# Altium schematic sheet WheatstoneBridge.SchDoc
size A3
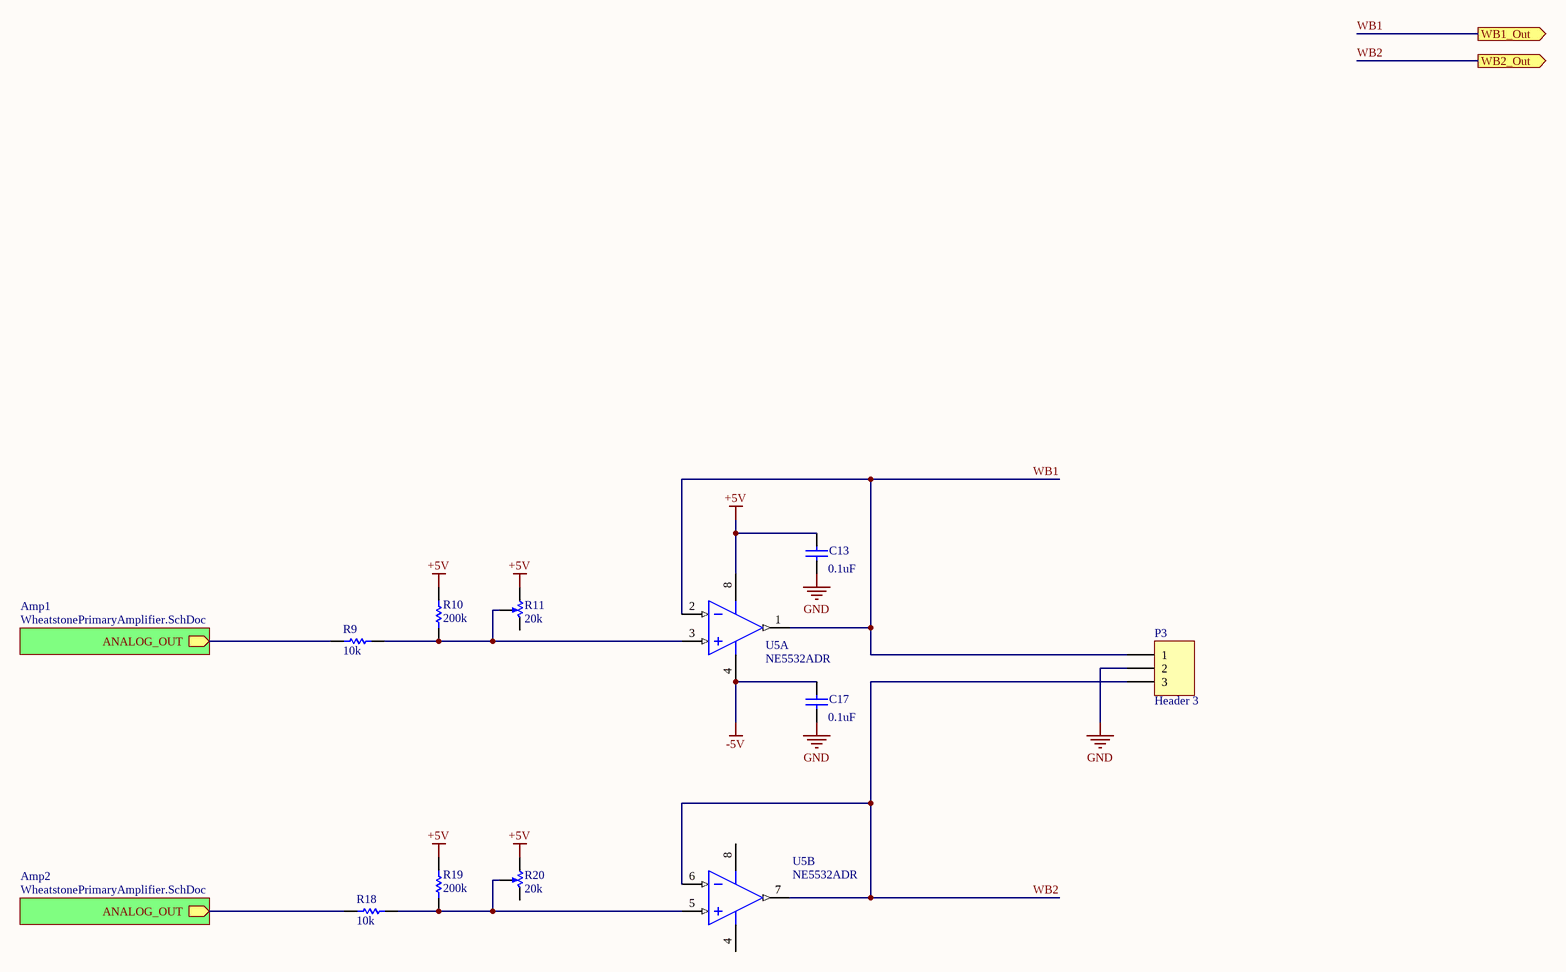
[diagram p0: WheatstoneBridge.SchDoc]

## Parts
C13  value 0.1uF  [1608[0603]]  (hidden comment: Cap Semi)
C17  value 0.1uF  [1608[0603]]  (hidden comment: Cap Semi)
P3  Header 3  [HDR1X3]
R9  10k  [RESC1608X55X25ML10T15]
R10  200k  [RESC1608X55X25ML10T15]
R11  20k  [Trimpot_Cut_tape_3.4x3.4x2]
R18  10k  [RESC1608X55X25ML10T15]
R19  200k  [RESC1608X55X25ML10T15]
R20  20k  [Trimpot_Cut_tape_3.4x3.4x2]
U5  NE5532ADR  [D0008A_M]  (parts A,B of 2)

## Sub-sheets
Amp1 = WheatstonePrimaryAmplifier.SchDoc: ANALOG_OUT (out)
Amp2 = WheatstonePrimaryAmplifier.SchDoc: ANALOG_OUT (out)

## Ports
WB1_Out (out), WB2_Out (out)

## Nets
+5V: C13.1 R10.1 R11.1 R19.1 R20.1 U5.8(VCC+)
-5V: C17.1 U5.4(VCC-)
GND: C13.2 C17.2 P3.2
WB1: P3.1 U5.1(OUT1) U5.2(IN1-) ; port WB1_Out
WB2: P3.3 U5.6(IN2-) U5.7(OUT2) ; port WB2_Out
NetR9_1: R9.1 R10.2 R11.2 U5.3(IN1+)
NetR9_2: R9.2 ; sheet Amp1/ANALOG_OUT
NetR18_1: R18.1 R19.2 R20.2 U5.5(IN2+)
NetR18_2: R18.2 ; sheet Amp2/ANALOG_OUT

Not connected (* = marked no-connect by the designer): R11 3; R20 3

## Notes on the sheet
- Title
- Size:
- Date:
- A3
- Number:
- Time:
- Revision:
- Sheet
- of
- File:

## Library data of the parts
C13 C17 = Cap Semi: Capacitor (Semiconductor SIM Model); Published: 8-Jun-2000; LatestRevisionDate: 29-May-2009; LatestRevisionNote: IPC-7351 Footprint Added.; PackageReference: C1206; Publisher: Altium Limited; PackageDescription: Chip Capacitor; Supplier 1: Digi-Key; Supplier Part Number 1: 490-10901-1-ND
P3 = Header 3: Header, 3-Pin; LatestRevisionDate: 17-Jul-2002; LatestRevisionNote: Re-released for DXP Platform.; Publisher: Altium Limited
R9 R10 R18 R19 = CMP-1659-00009-3: Chip Resistor, 1 KOhm, +/-1%, 0.1 W, -55 to 155 degC, 0603 (1608 Metric), RoHS, Tape and Reel; Voltage Rating: 50 V; PackageReference: 0603; Packaging: Tape and Reel; DatasheetVersion: Rev. 4, 02/2016; REACH SVHC: No SVHC; Height: 0.45 mm; Pins: 2; Length: 1.6 mm; Max Operating Temperature: 155 degC; Mounting Technology: Surface Mount; Mount: Surface Mount; Package Quantity: 200; Min Operating Temperature: -55 degC; RoHSCompliant: true; PackageDescription: 2-Pin Surface Mount Device, Body 1.6 x 0.8 mm
R11 R20 = Component_1
U5 = CMP-0017-00450-2: Dual Low-Noise Operational Amplifier, 10 to 30 V, 0 to 70 degC, 8-pin SOIC (D8), Green (RoHS & no Sb/Br); Manufacturer: Texas Instruments; Total Supply Voltage(Min)(+5V is 5, +/-5V is 10): 10; Slew Rate(Typ)(V/us): 9; Sub Family: General Purpose Amplifier, High Supply Voltage Amplifier (>=30V), Low Noise Amp (<=10nV/rtHz); Vio (25C)(Max)(mV): 4; IIB(Max)(pA): 800000; Vn at 1kHz(Typ)(nV/rtHz): 5; Number of Channels: 2; Total Supply Voltage(Max)(+5V is 5, +/-5V is 10): 30; CMRR(Min)(dB): 70; Code_JEDEC: MS-012; ComponentLink1URL: http://www.ti.com/; DatasheetVersion: SLOS075I; PackageDescription: 8-Pin Plastic Small Outline, Body 4.9 x 3.9 mm, Pitch 1.27 mm; Eco-Plan: Green (RoHS & no Sb/Br); ComponentLink3Description: Package Specification; PackageReference: D0008A; Mounting Technology: Surface Mount; GBW(Typ)(MHz): 10; ComponentLink2Description: Datasheet; ComponentLink1Description: Manufacturer URL; PartNumber: NE5532ADR; ComponentLink3URL: http://www.ti.com/litv/pdf/msoi002j; PackageVersion: 4040047-3/M, 06/2011; ComponentLink2URL: http://www.ti.com/lit/ds/symlink/ne5532a.pdf; Iq per channel(Max)(mA): 4